# Altium schematic sheet LEDs.SchDoc: [Untitled]
size A3; Author: Nędzny Janusz; CompanyName: SensDx S.A.; Organization: SensDx S.A.; Address1: Wrocław Laboratories; SheetNumber: 1; SheetTotal: 1
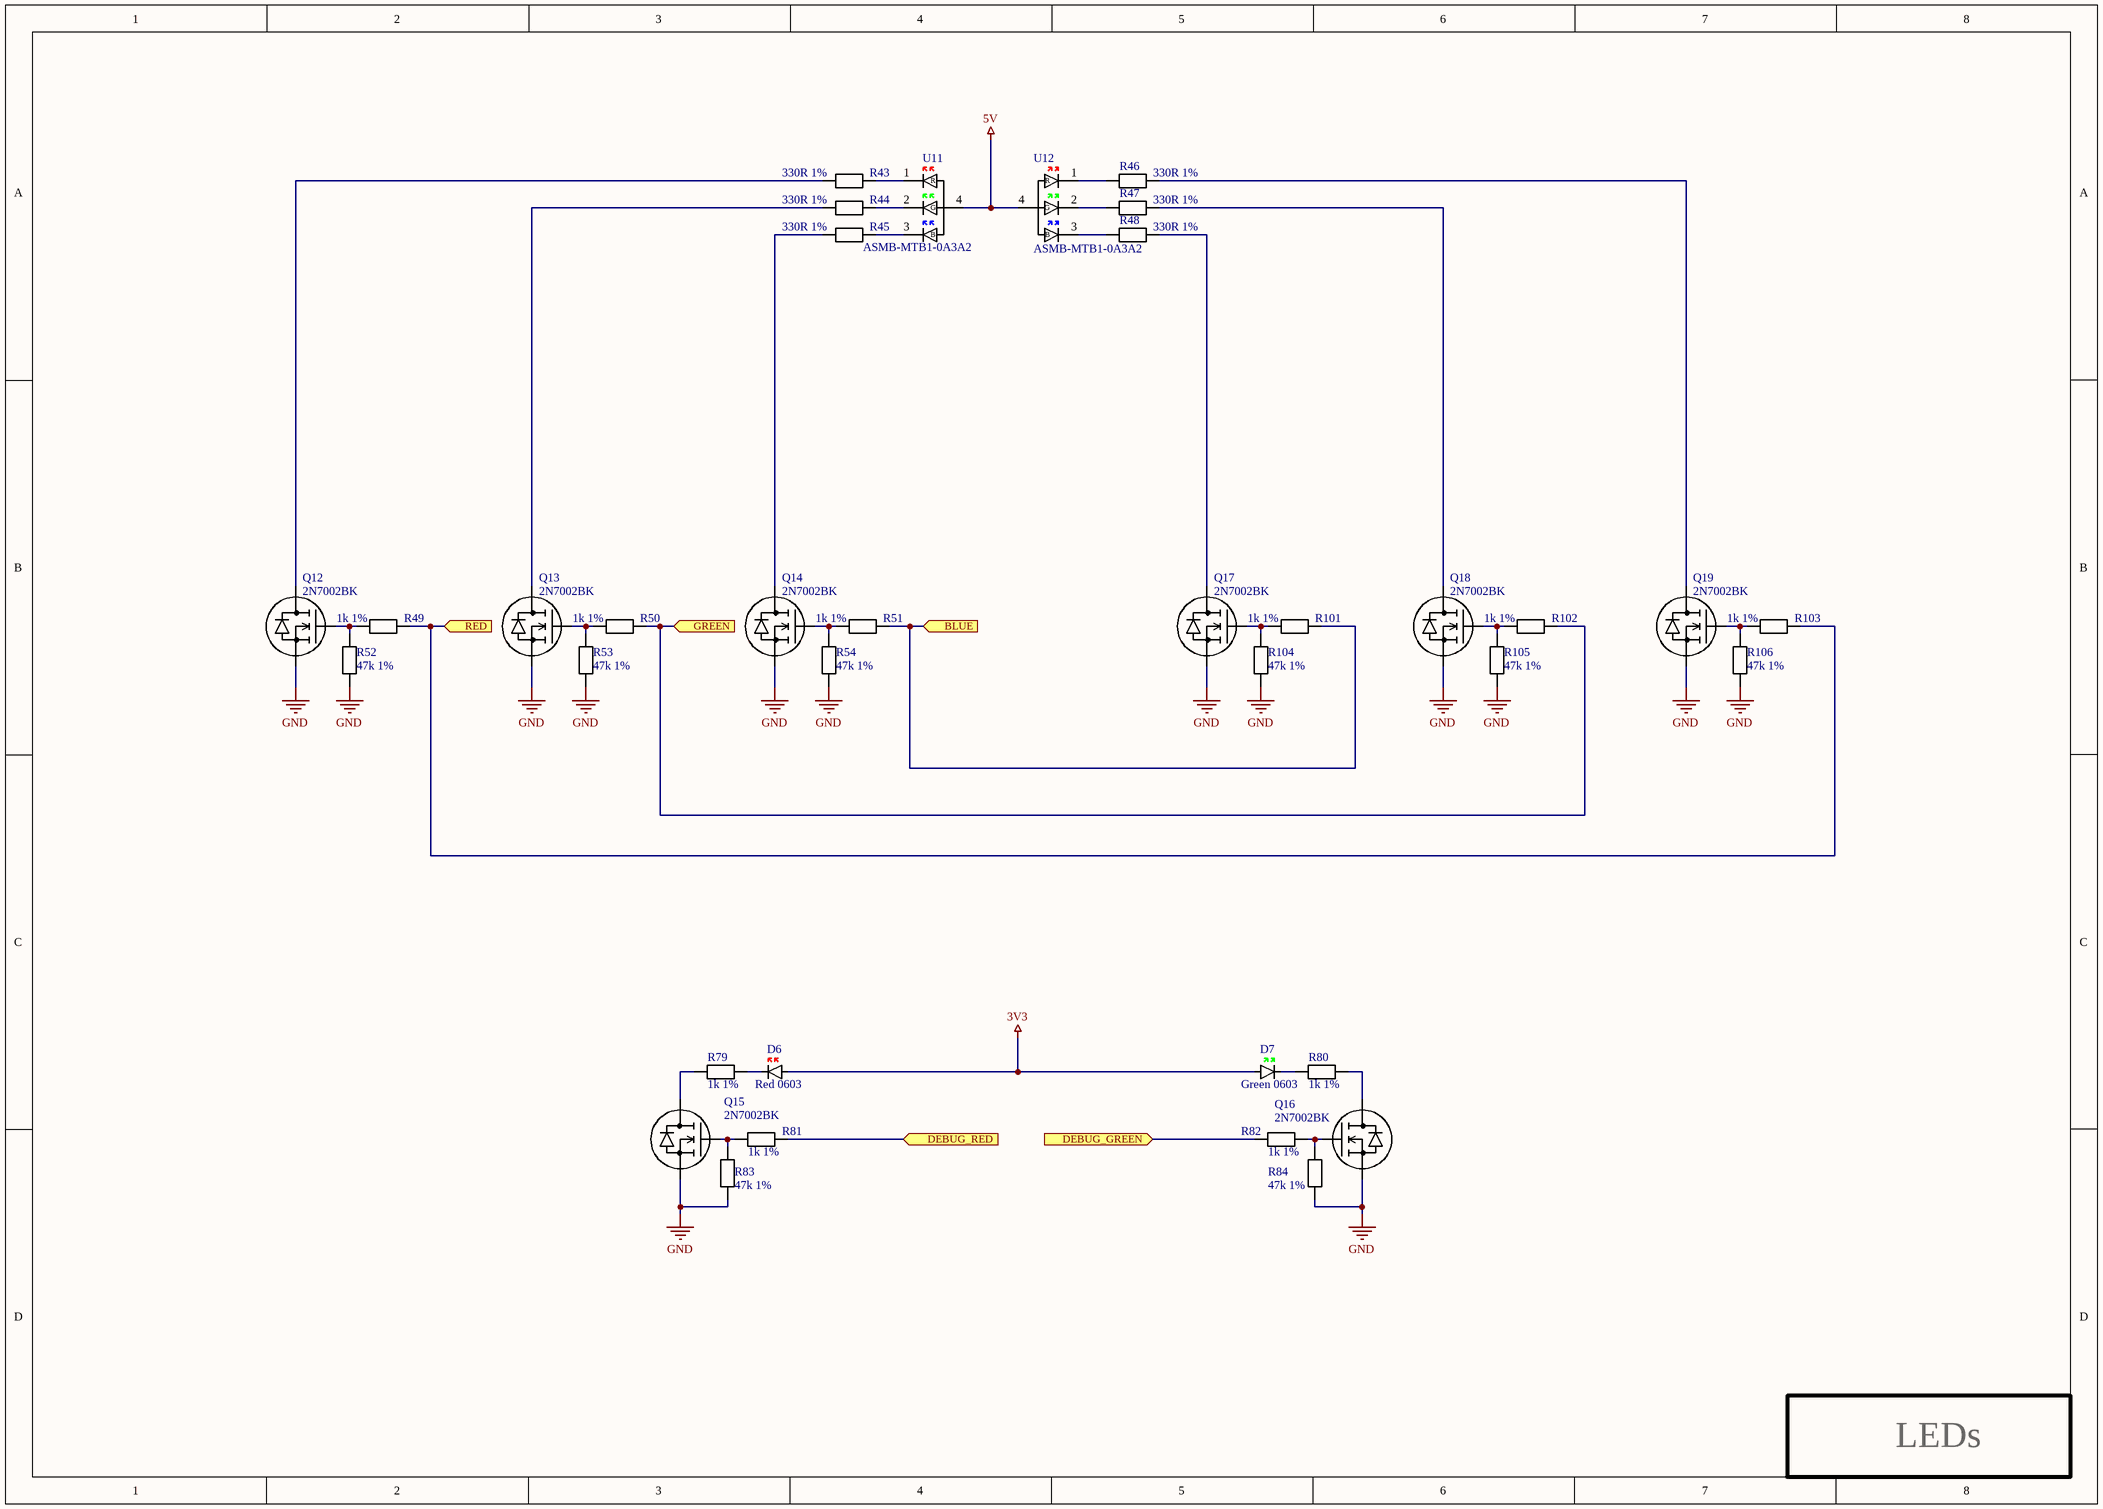
[diagram p0: LEDs.SchDoc]

## Parts
D6  Red 0603  [LED_0603_AUTO]
D7  Green 0603  [LED_0603_AUTO]
Q12  2N7002BK  [SOT23-3_AUTO]
Q13  2N7002BK  [SOT23-3_AUTO]
Q14  2N7002BK  [SOT23-3_AUTO]
Q15  2N7002BK  [SOT23-3_AUTO]
Q16  2N7002BK  [SOT23-3_AUTO]
Q17  2N7002BK  [SOT23-3_AUTO]
Q18  2N7002BK  [SOT23-3_AUTO]
Q19  2N7002BK  [SOT23-3_AUTO]
R43  330R 1%  [R_0603_AUTO]
R44  330R 1%  [R_0603_AUTO]
R45  330R 1%  [R_0603_AUTO]
R46  330R 1%  [R_0603_AUTO]
R47  330R 1%  [R_0603_AUTO]
R48  330R 1%  [R_0603_AUTO]
R49  1k 1%  [R_0603_AUTO]
R50  1k 1%  [R_0603_AUTO]
R51  1k 1%  [R_0603_AUTO]
R52  47k 1%  [R_0603_AUTO]
R53  47k 1%  [R_0603_AUTO]
R54  47k 1%  [R_0603_AUTO]
R79  1k 1%  [R_0603_AUTO]
R80  1k 1%  [R_0603_AUTO]
R81  1k 1%  [R_0603_AUTO]
R82  1k 1%  [R_0603_AUTO]
R83  47k 1%  [R_0603_AUTO]
R84  47k 1%  [R_0603_AUTO]
R101  1k 1%  [R_0603_AUTO]
R102  1k 1%  [R_0603_AUTO]
R103  1k 1%  [R_0603_AUTO]
R104  47k 1%  [R_0603_AUTO]
R105  47k 1%  [R_0603_AUTO]
R106  47k 1%  [R_0603_AUTO]
U11  ASMB-MTB1-0A3A2  [PLCC4]
U12  ASMB-MTB1-0A3A2  [PLCC4]

## Ports
BLUE (in), DEBUG_GREEN (in), DEBUG_RED (in), GREEN (in), RED (in)

## Nets
3V3: D6.2(A) D7.2(A)
5V: U11.4 U12.4
GND: Q12.2(S) Q13.2(S) Q14.2(S) Q15.2(S) Q16.2(S) Q17.2(S) Q18.2(S) Q19.2(S) R52.2 R53.2 R54.2 R83.2 R84.2 R104.2 R105.2 R106.2
BLUE: R51.1 R101.1 ; port BLUE
DEBUG_GREEN: R82.1 ; port DEBUG_GREEN
DEBUG_RED: R81.2 ; port DEBUG_RED
GREEN: R50.1 R102.1 ; port GREEN
RED: R49.1 R103.1 ; port RED
NetD6_1: D6.1(C) R79.1
NetD7_1: D7.1(C) R80.1
NetQ12_1: Q12.1(G) R49.2 R52.1
NetQ12_3: Q12.3(D) R43.2
NetQ13_1: Q13.1(G) R50.2 R53.1
NetQ13_3: Q13.3(D) R44.2
NetQ14_1: Q14.1(G) R51.2 R54.1
NetQ14_3: Q14.3(D) R45.2
NetQ15_1: Q15.1(G) R81.1 R83.1
NetQ15_3: Q15.3(D) R79.2
NetQ16_1: Q16.1(G) R82.2 R84.1
NetQ16_3: Q16.3(D) R80.2
NetQ17_1: Q17.1(G) R101.2 R104.1
NetQ17_3: Q17.3(D) R48.2
NetQ18_1: Q18.1(G) R102.2 R105.1
NetQ18_3: Q18.3(D) R47.2
NetQ19_1: Q19.1(G) R103.2 R106.1
NetQ19_3: Q19.3(D) R46.2
NetR43_1: R43.1 U11.1(R)
NetR44_1: R44.1 U11.2(G)
NetR45_1: R45.1 U11.3(B)
NetR46_1: R46.1 U12.1(R)
NetR47_1: R47.1 U12.2(G)
NetR48_1: R48.1 U12.3(B)

## Notes on the sheet
- LEDs
- Title:
- Project name:
- Last modification:
- Author:
- Version control rev.:
- Sheet:
- /
- Sheet size:
- Variant:
- File name:
- A3
- Altium build:

## Library data of the parts
D6 = LED_Red_0603: Generic Red 0603; MPN: [Generic]; Value: Red; Manufacturer: [Generic]
D7 = LED_Green_0603: Generic Green 0603; Manufacturer: [Generic]; MPN: [Generic]; Value: Green
Q12-Q19 = 2N7002BK: 60 V, 350 mA N-channel Trench MOSFET Vth=1.6V; Manufacturer: Nexperia; Value: NA; MPN: 2N7002BK; ComponentLink1Description: Datasheet; ComponentLink1URL: https://assets.nexperia.com/documents/data-sheet/2N7002BK.pdf; Supplier 1: Mouser; Supplier 2: Digi-Key; Supplier Part Number 1: 771-2N7002BK215; Supplier Part Number 2: 1727-4789-2-ND
R43-R54 R79-R84 R101-R106 = Resistor: MPN: [Generic]; Manufacturer: [Generic]
  R43-R48: Value: 330R 1%
  R49-R51 R79-R82 R101-R103: Value: 1k 1%
  R52-R54 R83 R84 R104-R106: Value: 47k 1%
U11 U12 = ASMB-MTB1-0A3A2: LED RGB DIFFUSED 4PLCC SMD; Manufacturer: Broadcom Limited; Value: NA; MPN: ASMB-MTB1-0A3A2; Supplier 1: Farnell; Supplier 2: Mouser; Supplier 3: Digi-Key; Supplier Part Number 1: 2401106RL; Supplier Part Number 2: 630-ASMB-MTB1-0A3A2; Supplier Part Number 3: 516-3280-6-ND; ComponentLink1Description: Product page; ComponentLink1URL: https://www.broadcom.com/products/leds-and-displays/surface-mount-plcc/plcc-4-leds/multi-color/asmb-mtb1-0a3a2#overview